# Altium project PCB_Project.PrjPcb
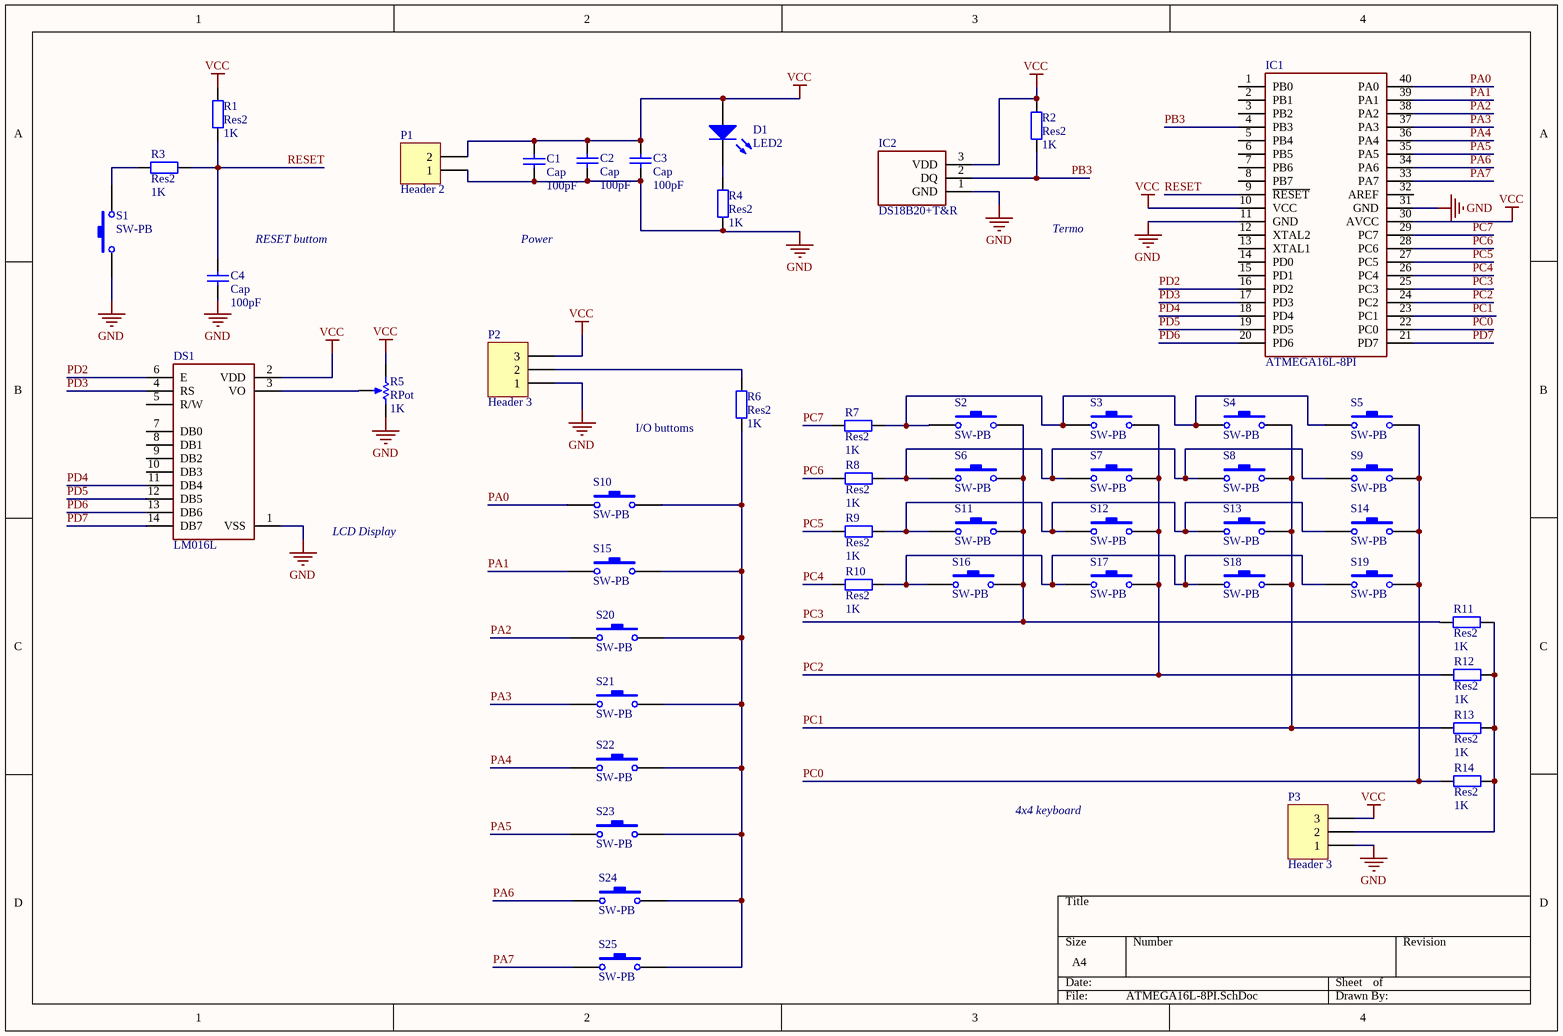
[diagram p0: ATMEGA16L-8PI.SchDoc]
1 sheet, 50 parts. Net scope: global (net labels, ports and power ports of the same name join across sheets).
Board file: PCB1.PcbDoc

## Sheet ATMEGA16L-8PI.SchDoc
size A4

### Parts
C1  Cap  value 100pF  [RAD-0.3]
C2  Cap  value 100pF  [RAD-0.3]
C3  Cap  value 100pF  [RAD-0.3]
C4  Cap  value 100pF  [RAD-0.3]
D1  LED2  [3.2X1.6X1.1]
DS1  LM016L  [LCD_LM016L]
IC1  ATMEGA16L-8PI  [DIP1556W56P254L5232H483Q40N]
IC2  DS18B20+T&R  [DS18B20TR]
P1  Header 2  [HDR1X2]
P2  Header 3  [HDR1X3]
P3  Header 3  [HDR1X3]
R1  Res2  value 1K  [AXIAL-0.4]
R2  Res2  value 1K  [AXIAL-0.4]
R3  Res2  value 1K  [AXIAL-0.4]
R4  Res2  value 1K  [AXIAL-0.4]
R5  RPot  value 1K  [VR5]
R6  Res2  value 1K  [AXIAL-0.4]
R7  Res2  value 1K  [AXIAL-0.4]
R8  Res2  value 1K  [AXIAL-0.4]
R9  Res2  value 1K  [AXIAL-0.4]
R10  Res2  value 1K  [AXIAL-0.4]
R11  Res2  value 1K  [AXIAL-0.4]
R12  Res2  value 1K  [AXIAL-0.4]
R13  Res2  value 1K  [AXIAL-0.4]
R14  Res2  value 1K  [AXIAL-0.4]
S1  SW-PB  [SPST-2]
S2  SW-PB  [SPST-2]
S3  SW-PB  [SPST-2]
S4  SW-PB  [SPST-2]
S5  SW-PB  [SPST-2]
S6  SW-PB  [SPST-2]
S7  SW-PB  [SPST-2]
S8  SW-PB  [SPST-2]
S9  SW-PB  [SPST-2]
S10  SW-PB  [SPST-2]
S11  SW-PB  [SPST-2]
S12  SW-PB  [SPST-2]
S13  SW-PB  [SPST-2]
S14  SW-PB  [SPST-2]
S15  SW-PB  [SPST-2]
S16  SW-PB  [SPST-2]
S17  SW-PB  [SPST-2]
S18  SW-PB  [SPST-2]
S19  SW-PB  [SPST-2]
S20  SW-PB  [SPST-2]
S21  SW-PB  [SPST-2]
S22  SW-PB  [SPST-2]
S23  SW-PB  [SPST-2]
S24  SW-PB  [SPST-2]
S25  SW-PB  [SPST-2]

### Nets
GND: C1.1 C2.1 C3.1 C4.1 DS1.1(VSS) IC1.11(GND) IC1.31(GND) IC2.1(GND) P1.1 P2.1 P3.1 R4.2 R5.2(BOT) S1.1
VCC: C1.2 C2.2 C3.2 D1.1(A) DS1.2(VDD) IC1.10(VCC) IC1.30(AVCC) IC2.3(VDD) P1.2 P2.3 P3.3 R1.2 R2.2 R5.1(TOP)
PA0: IC1.40(PA0) S10.1
PA1: IC1.39(PA1) S15.1
PA2: IC1.38(PA2) S20.1
PA3: IC1.37(PA3) S21.1
PA4: IC1.36(PA4) S22.1
PA5: IC1.35(PA5) S23.1
PA6: IC1.34(PA6) S24.1
PA7: IC1.33(PA7) S25.1
PB3: IC1.4(PB3) IC2.2(DQ) R2.1
PC0: IC1.22(PC0) R14.2 S5.2 S9.2 S14.2 S19.2
PC1: IC1.23(PC1) R13.2 S4.2 S8.2 S13.2 S18.2
PC2: IC1.24(PC2) R12.2 S3.2 S7.2 S12.2 S17.2
PC3: IC1.25(PC3) R11.2 S2.2 S6.2 S11.2 S16.2
PC4: IC1.26(PC4) R10.2
PC5: IC1.27(PC5) R9.2
PC6: IC1.28(PC6) R8.2
PC7: IC1.29(PC7) R7.2
PD2: DS1.6(E) IC1.16(PD2)
PD3: DS1.4(RS) IC1.17(PD3)
PD4: DS1.11(DB4) IC1.18(PD4)
PD5: DS1.12(DB5) IC1.19(PD5)
PD6: DS1.13(DB6) IC1.20(PD6)
PD7: DS1.14(DB7) IC1.21(PD7)
RESET: C4.2 IC1.9(~{RESET}) R1.1 R3.1
NetD1_2: D1.2(K) R4.1
NetDS1_3: DS1.3(VO) R5.3(TAP)
NetP2_2: P2.2 R6.2
NetP3_2: P3.2 R11.1 R12.1 R13.1 R14.1
NetR3_2: R3.2 S1.2
NetR6_1: R6.1 S10.2 S15.2 S20.2 S21.2 S22.2 S23.2 S24.2 S25.2
NetR7_1: R7.1 S2.1 S3.1 S4.1 S5.1
NetR8_1: R8.1 S6.1 S7.1 S8.1 S9.1
NetR9_1: R9.1 S11.1 S12.1 S13.1 S14.1
NetR10_1: R10.1 S16.1 S17.1 S18.1 S19.1

Not connected (* = marked no-connect by the designer): DS1 5(R/W) 7(DB0) 8(DB1) 9(DB2) 10(DB3); IC1 1(PB0) 2(PB1) 3(PB2) 5(PB4) 6(PB5) 7(PB6) 8(PB7) 12(XTAL2) 13(XTAL1) 14(PD0) 15(PD1) 32(AREF)

### Notes on the sheet
- (near C4) RESET buttom
- Power
- Termo
- (near R6) I/O buttoms
- LCD Display
- 4x4 keyboard

### Library data of the parts
C1-C4 = Cap: Capacitor; Published: 8-Jun-2000; LatestRevisionDate: 17-Jul-2002; LatestRevisionNote: Re-released for DXP Platform.; PackageReference: RAD-0.3; Publisher: Altium Limited; PackageDescription: Radial Cap, Thru-Hole; 2 Leads; 0.3 in Pin Spacing
D1 = LED2: Typical RED, GREEN, YELLOW, AMBER GaAs LED; Published: 8-Jun-2000; LatestRevisionDate: 17-Jul-2002; LatestRevisionNote: Re-released for DXP Platform.; PackageVersion: Feb-2002; PackageReference: 3.2X1.6X1.1; Publisher: Altium Limited; PackageDescription: SM LED; 2 Flat Leads
DS1 = LM016L: Display Lcd 35x75mm; MF: Hitachi; MP: LM016L; Availability: Unavailable; Package: None; Value: *; Price: None; SnapEDA_Link: https://www.snapeda.com/parts/LM016L/Hitachi/view-part/229734/?ref=snap
IC1 = ATMEGA16L-8PI: Integrated Circuit; Manufacturer_Name: Microchip; Datasheet Link: http://www.microchip.com/mymicrochip/filehandler.aspx?ddocname=en590660; Height: 4.826mm; Manufacturer_Part_Number: ATMEGA16L-8PI; Mouser Part Number: 556-ATMEGA16L-8PI; Mouser Price/Stock: https://www.mouser.co.uk/ProductDetail/Microchip-Technology-Atmel/ATmega16L-8PI?qs=aqrrBurbvGfoTGm9tGS2ew%3D%3D
IC2 = DS18B20+T&R: Integrated Circuit; Manufacturer_Name: Maxim Integrated; Datasheet Link: https://componentsearchengine.com/Datasheets/1/DS18B20+T&R.pdf; Height: 10.41mm; Manufacturer_Part_Number: DS18B20+T&R; Mouser Part Number: 700-DS18B20T&R; Mouser Price/Stock: https://www.mouser.co.uk/ProductDetail/Maxim-Integrated/DS18B20%2bTR?qs=7H2Jq%252ByxpJKpIDCbiq4lfg%3D%3D
P1 = Header 2: Header, 2-Pin; LatestRevisionDate: 17-Jul-2002; LatestRevisionNote: Re-released for DXP Platform.; Publisher: Altium Limited
P2 P3 = Header 3: Header, 3-Pin; LatestRevisionDate: 17-Jul-2002; LatestRevisionNote: Re-released for DXP Platform.; Publisher: Altium Limited
R1-R4 R6-R14 = Res2: Resistor; Published: 8-Jun-2000; LatestRevisionDate: 17-Jul-2002; LatestRevisionNote: Re-released for DXP Platform.; PackageReference: AXIAL-0.4; Publisher: Altium Limited; PackageDescription: Axial Device, Thru-Hole; 2 Leads; 0.4 in Pin Spacing
R5 = RPot: Potentiometer; Sim Note: Enter the Resistance value and the set point into parameter fields.; Set Position: 0.5; Published: 8-Jun-2000; LatestRevisionDate: 17-Jul-2002; LatestRevisionNote: Re-released for DXP Platform.; PackageReference: VR5; Publisher: Altium Limited; PackageDescription: Variable Resistor, Thru-Hole; 3 Leads
S1-S25 = SW-PB: Switch; Published: 24-Mar-1999; LatestRevisionDate: 17-Jul-2002; LatestRevisionNote: Re-released for DXP Platform.; PackageReference: SPST-2; Publisher: Altium Limited; PackageDescription: Switch; 2 Leads